# EasyEDA schematic smart auto charger_2020-04-23_15-03-07.json

## Sheets
1 First stage: TITLE: DDS Generator Gain; REV: 1.1; Date: 2020-01-05; Sheet: 1/4; Drawn By: Груздев А.С.; Company: GROOZDEV
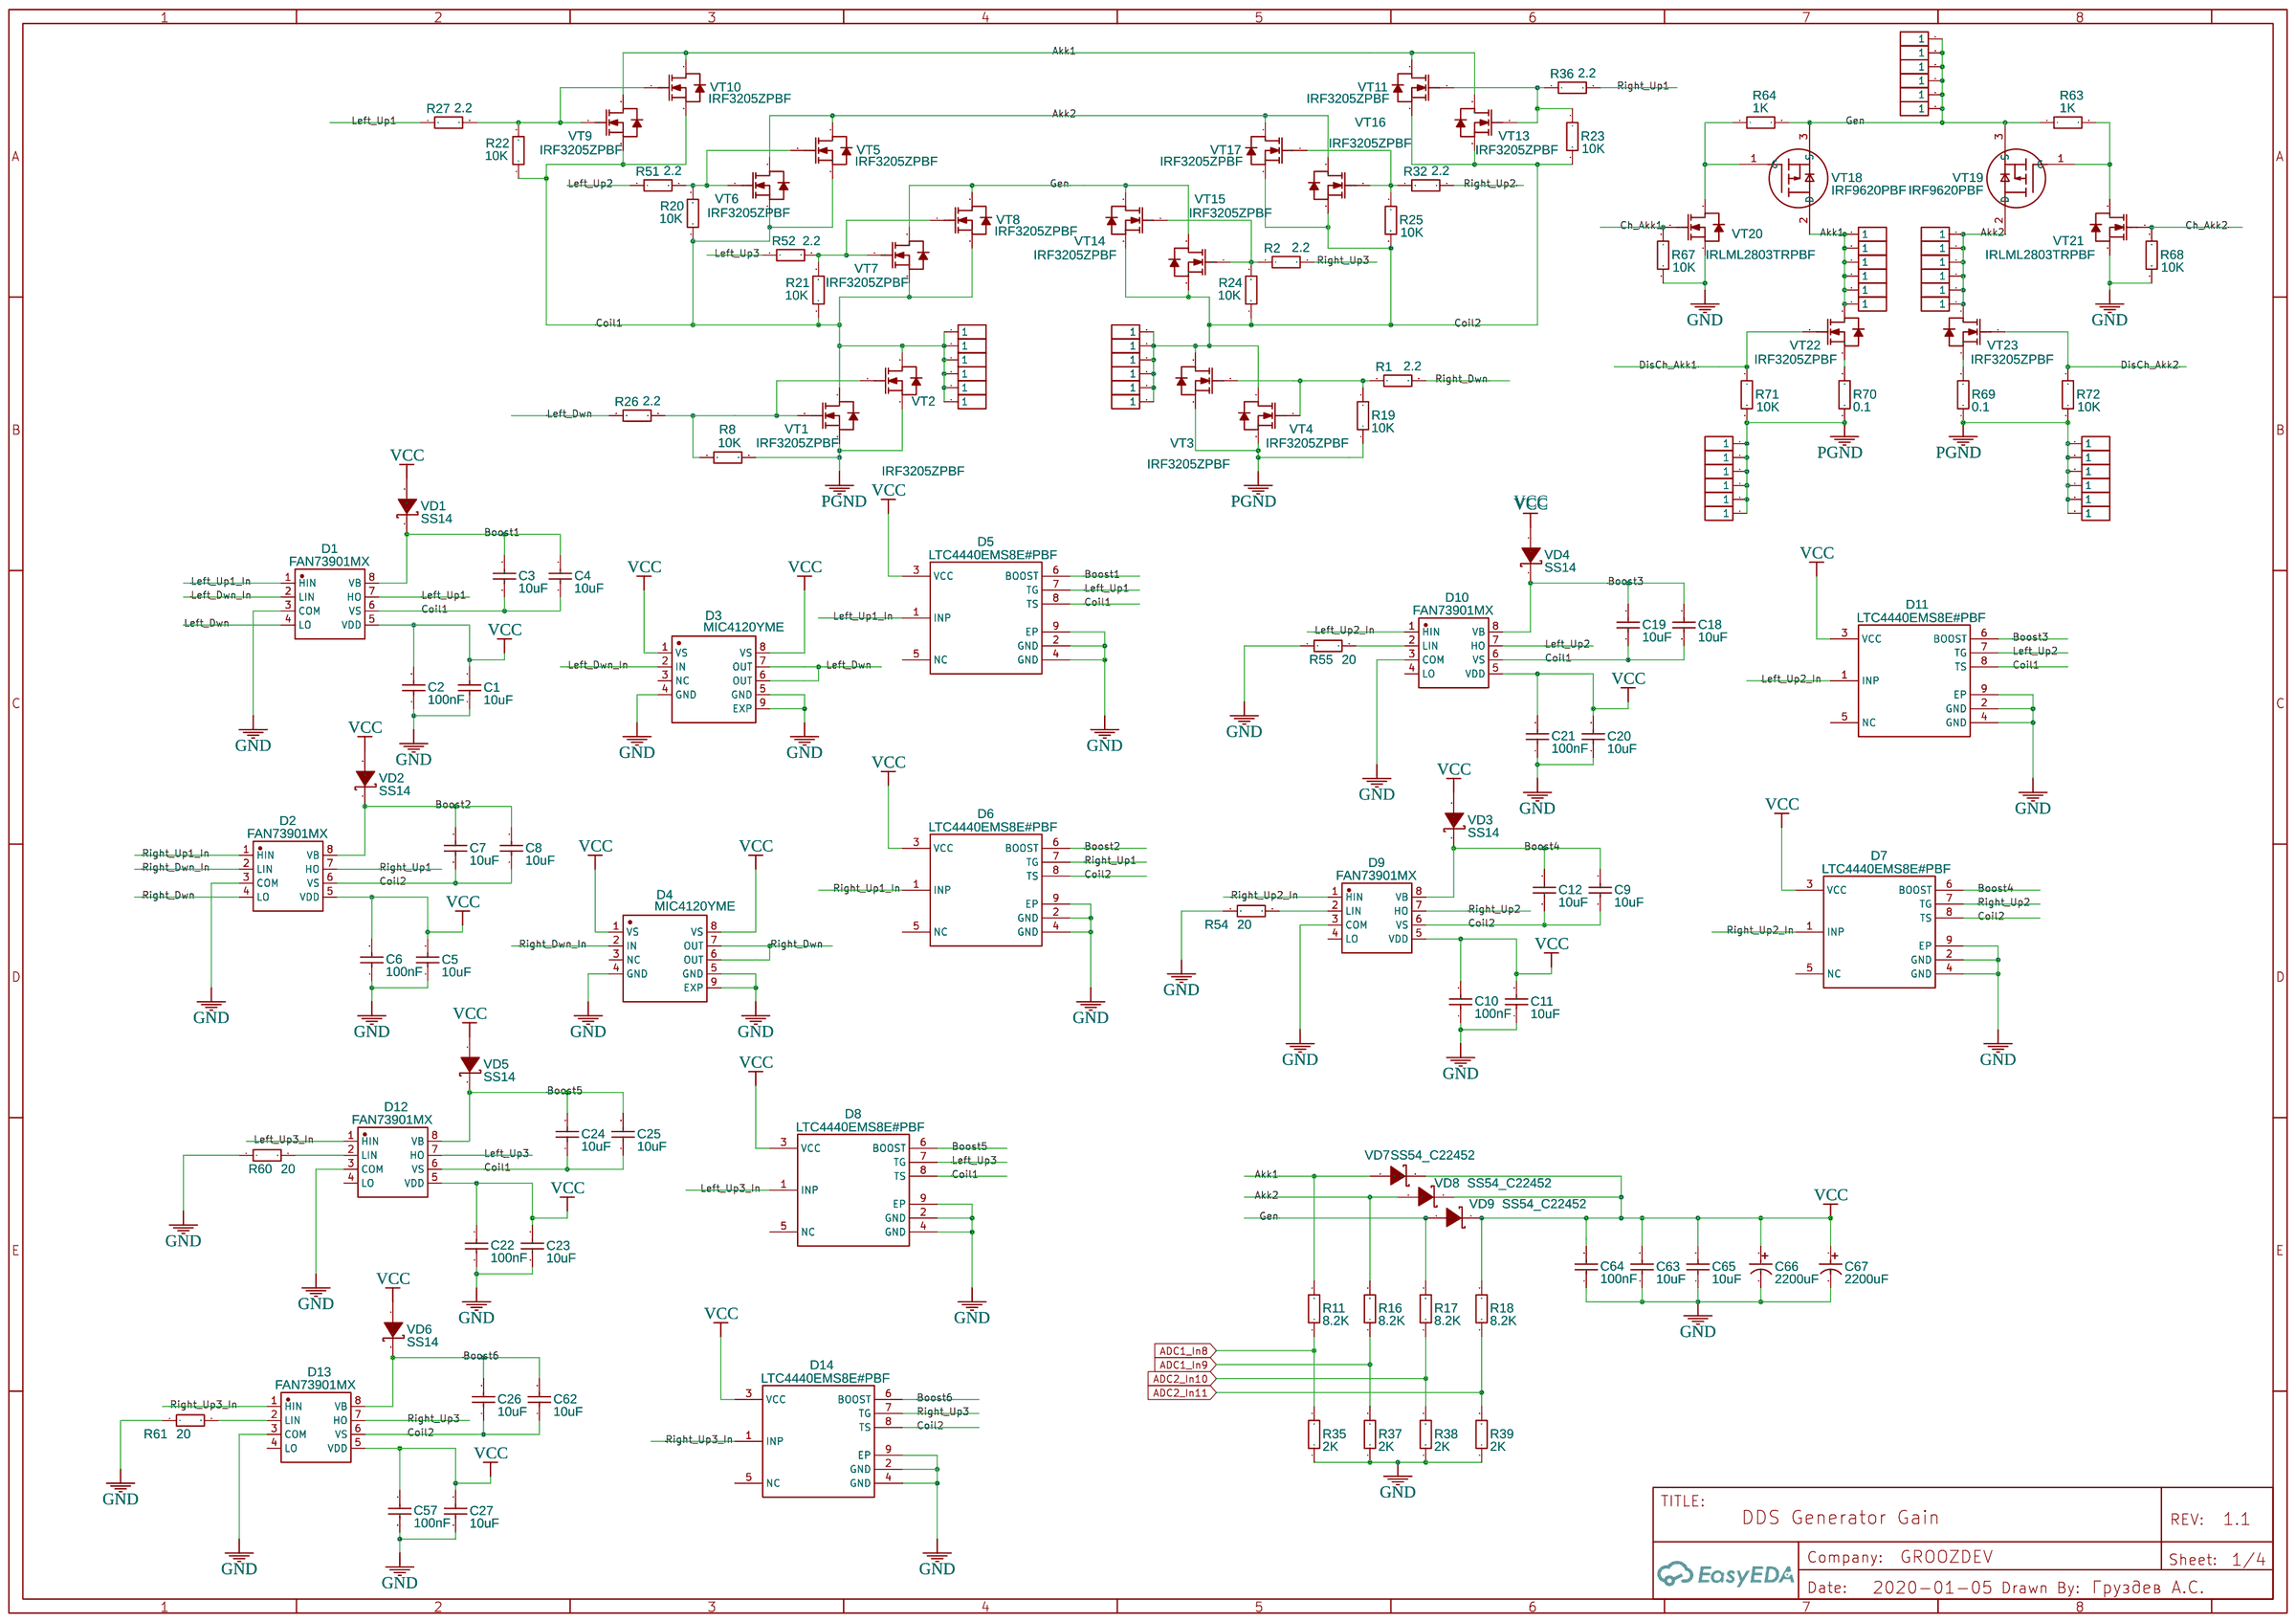
[diagram p0: First stage]
2 Second stage: TITLE: Ampifier; Date: 2020-01-06; Sheet: 2/4
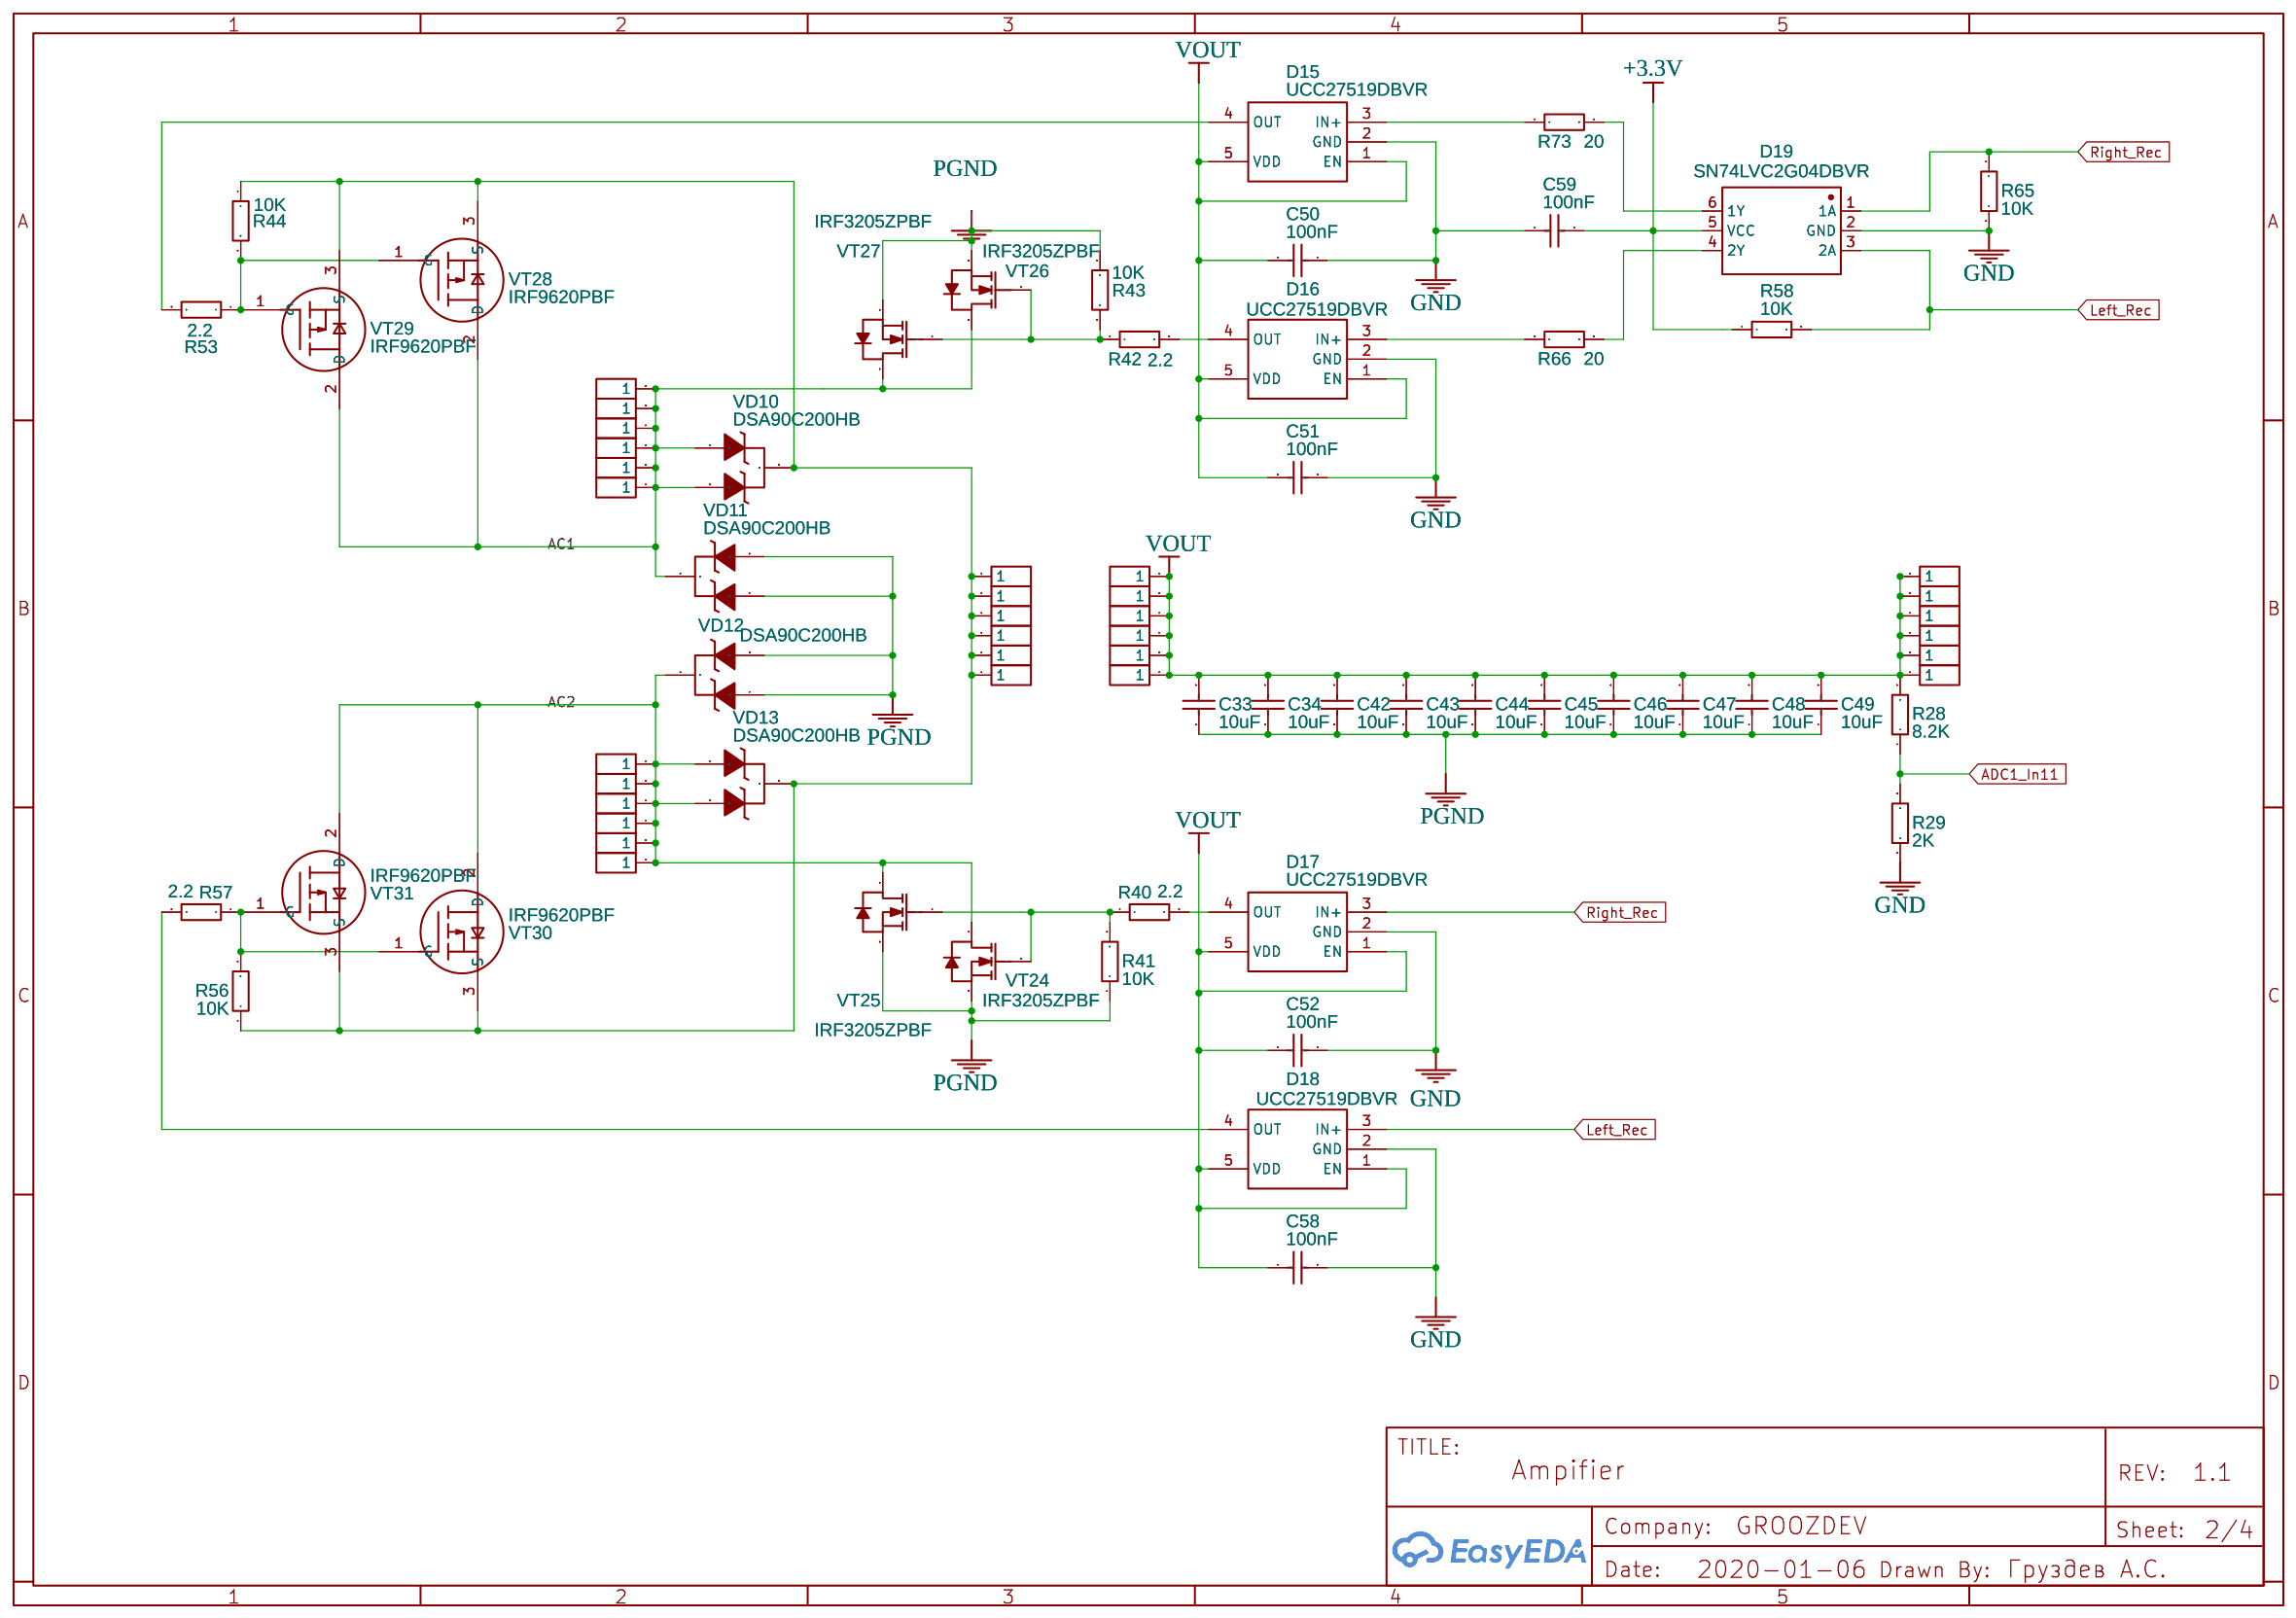
[diagram p1: Second stage]
3 USBtoVirtualCOM: TITLE: Interface; Date: 2020-01-15; Sheet: 3/4
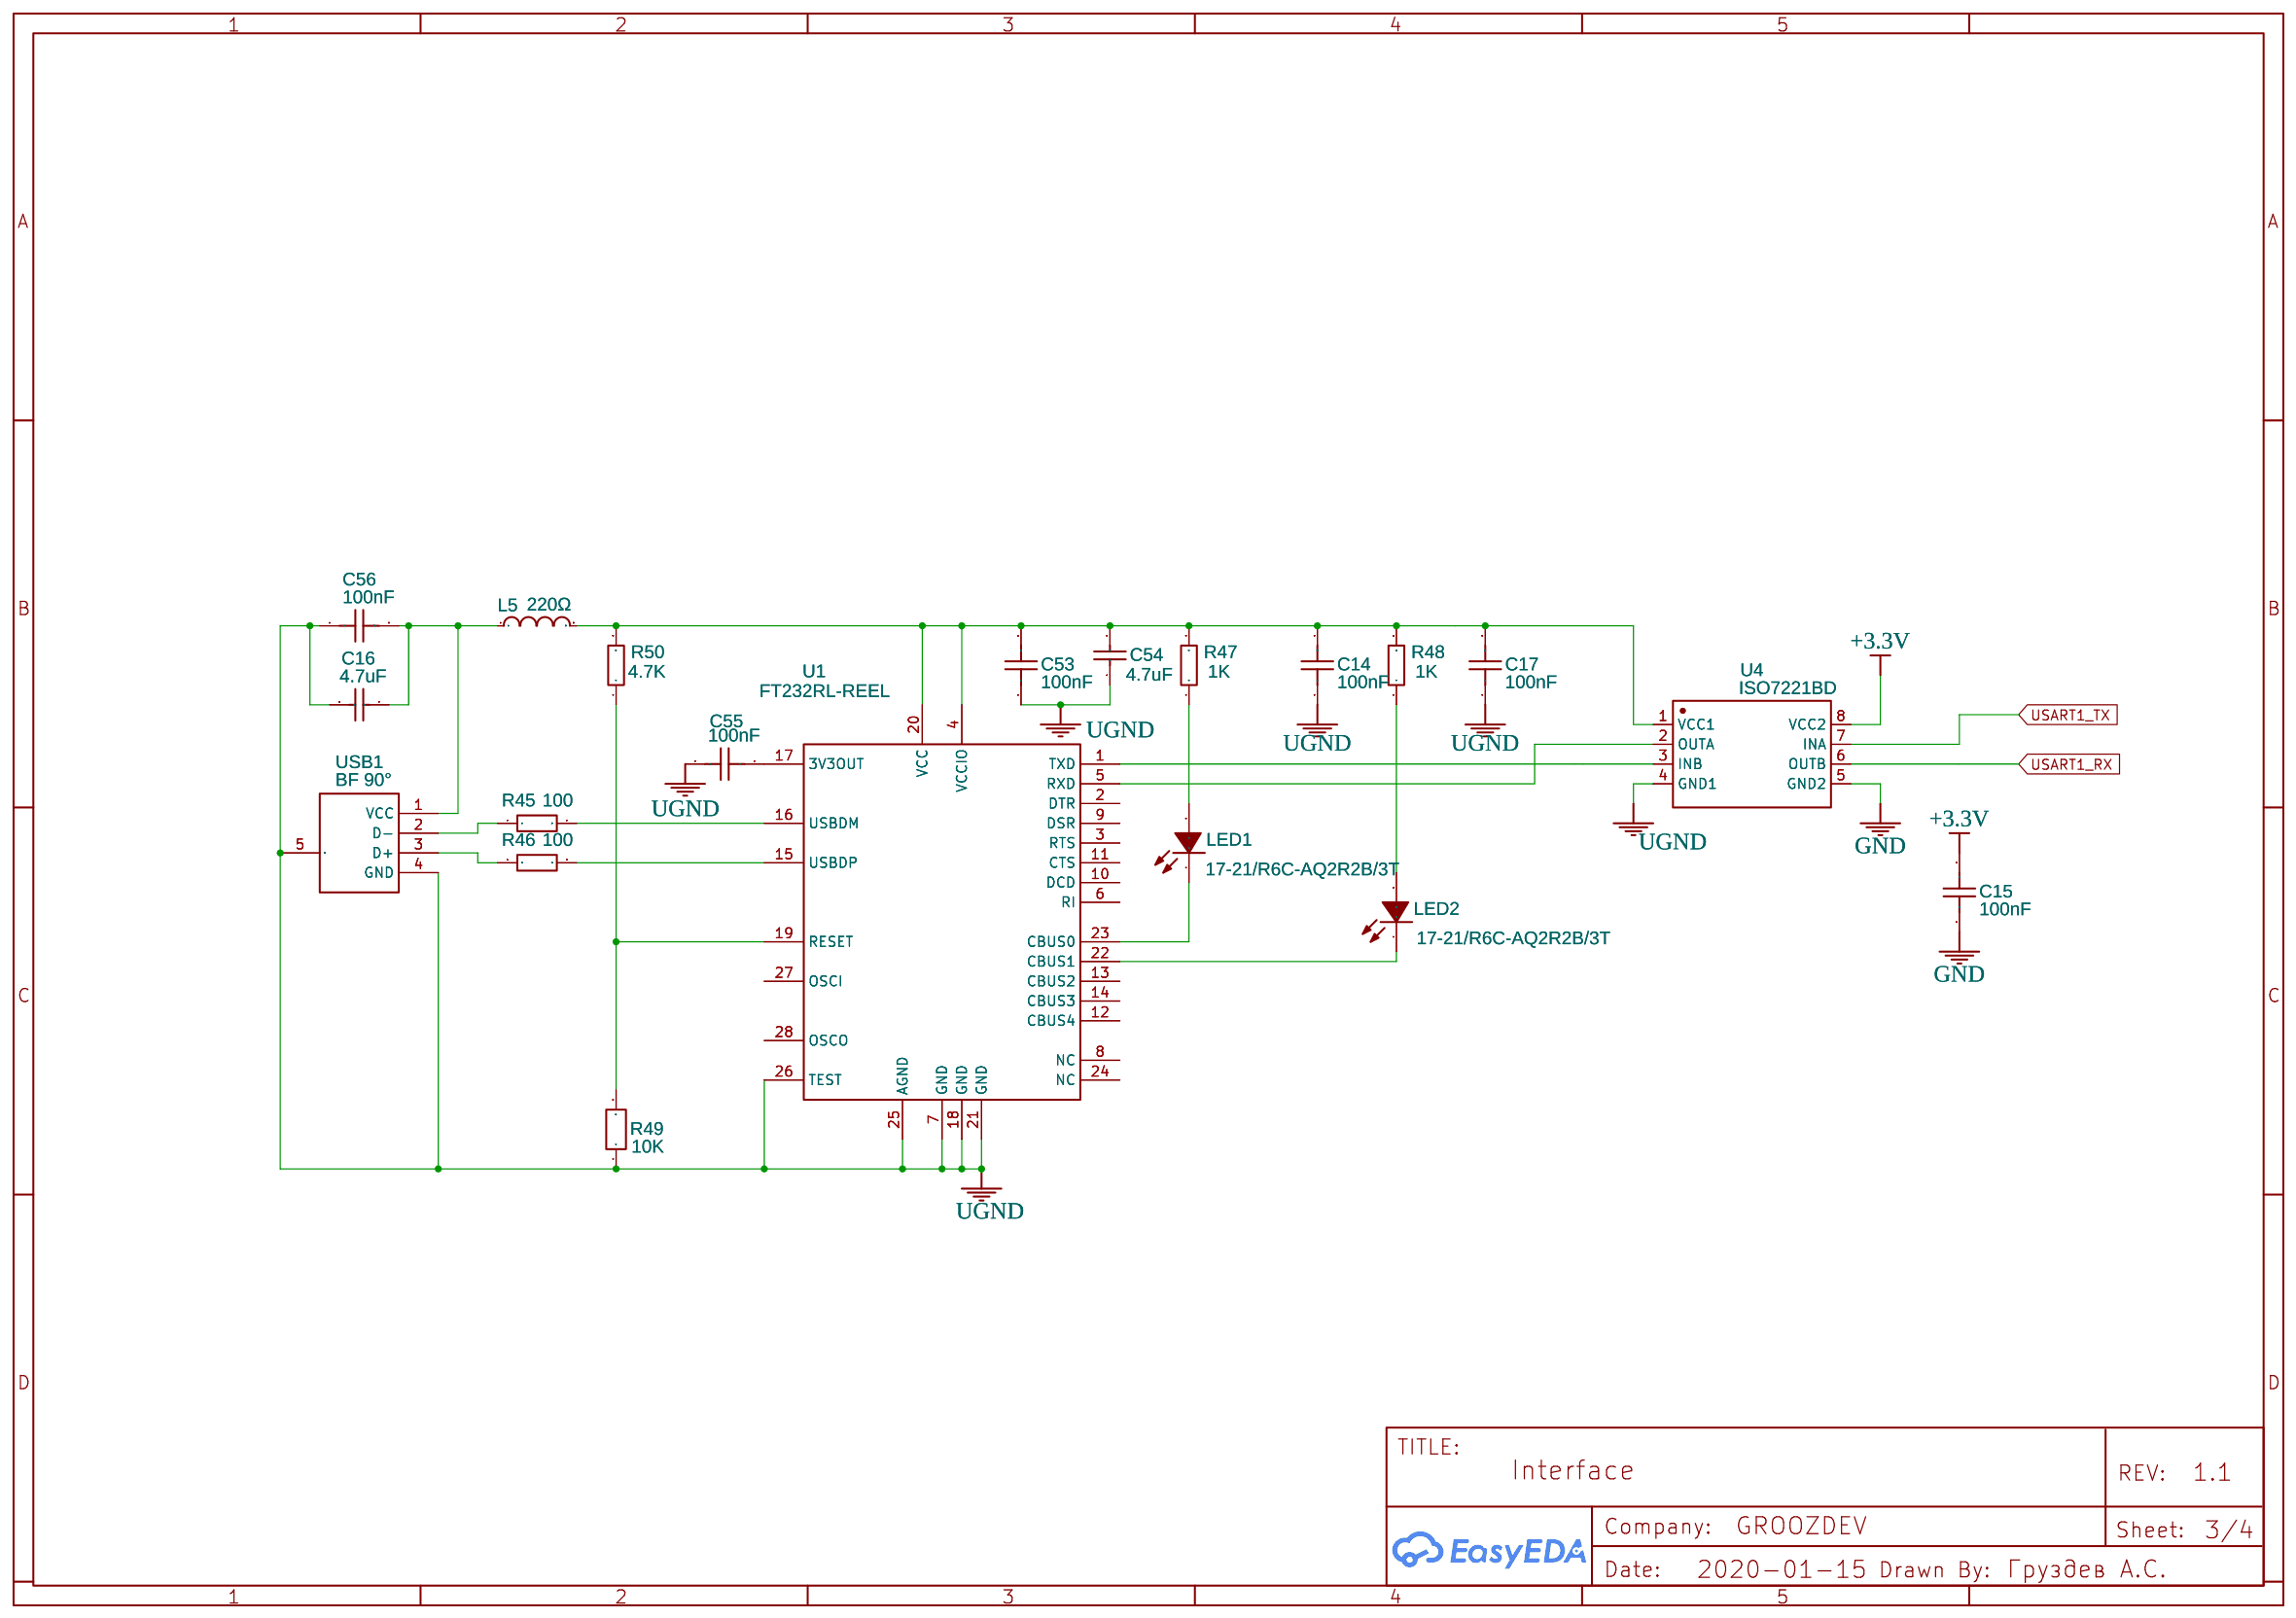
[diagram p2: USBtoVirtualCOM]
4 MCU_64: TITLE: MCU_64; Date: 2020-01-17; Sheet: 4/4
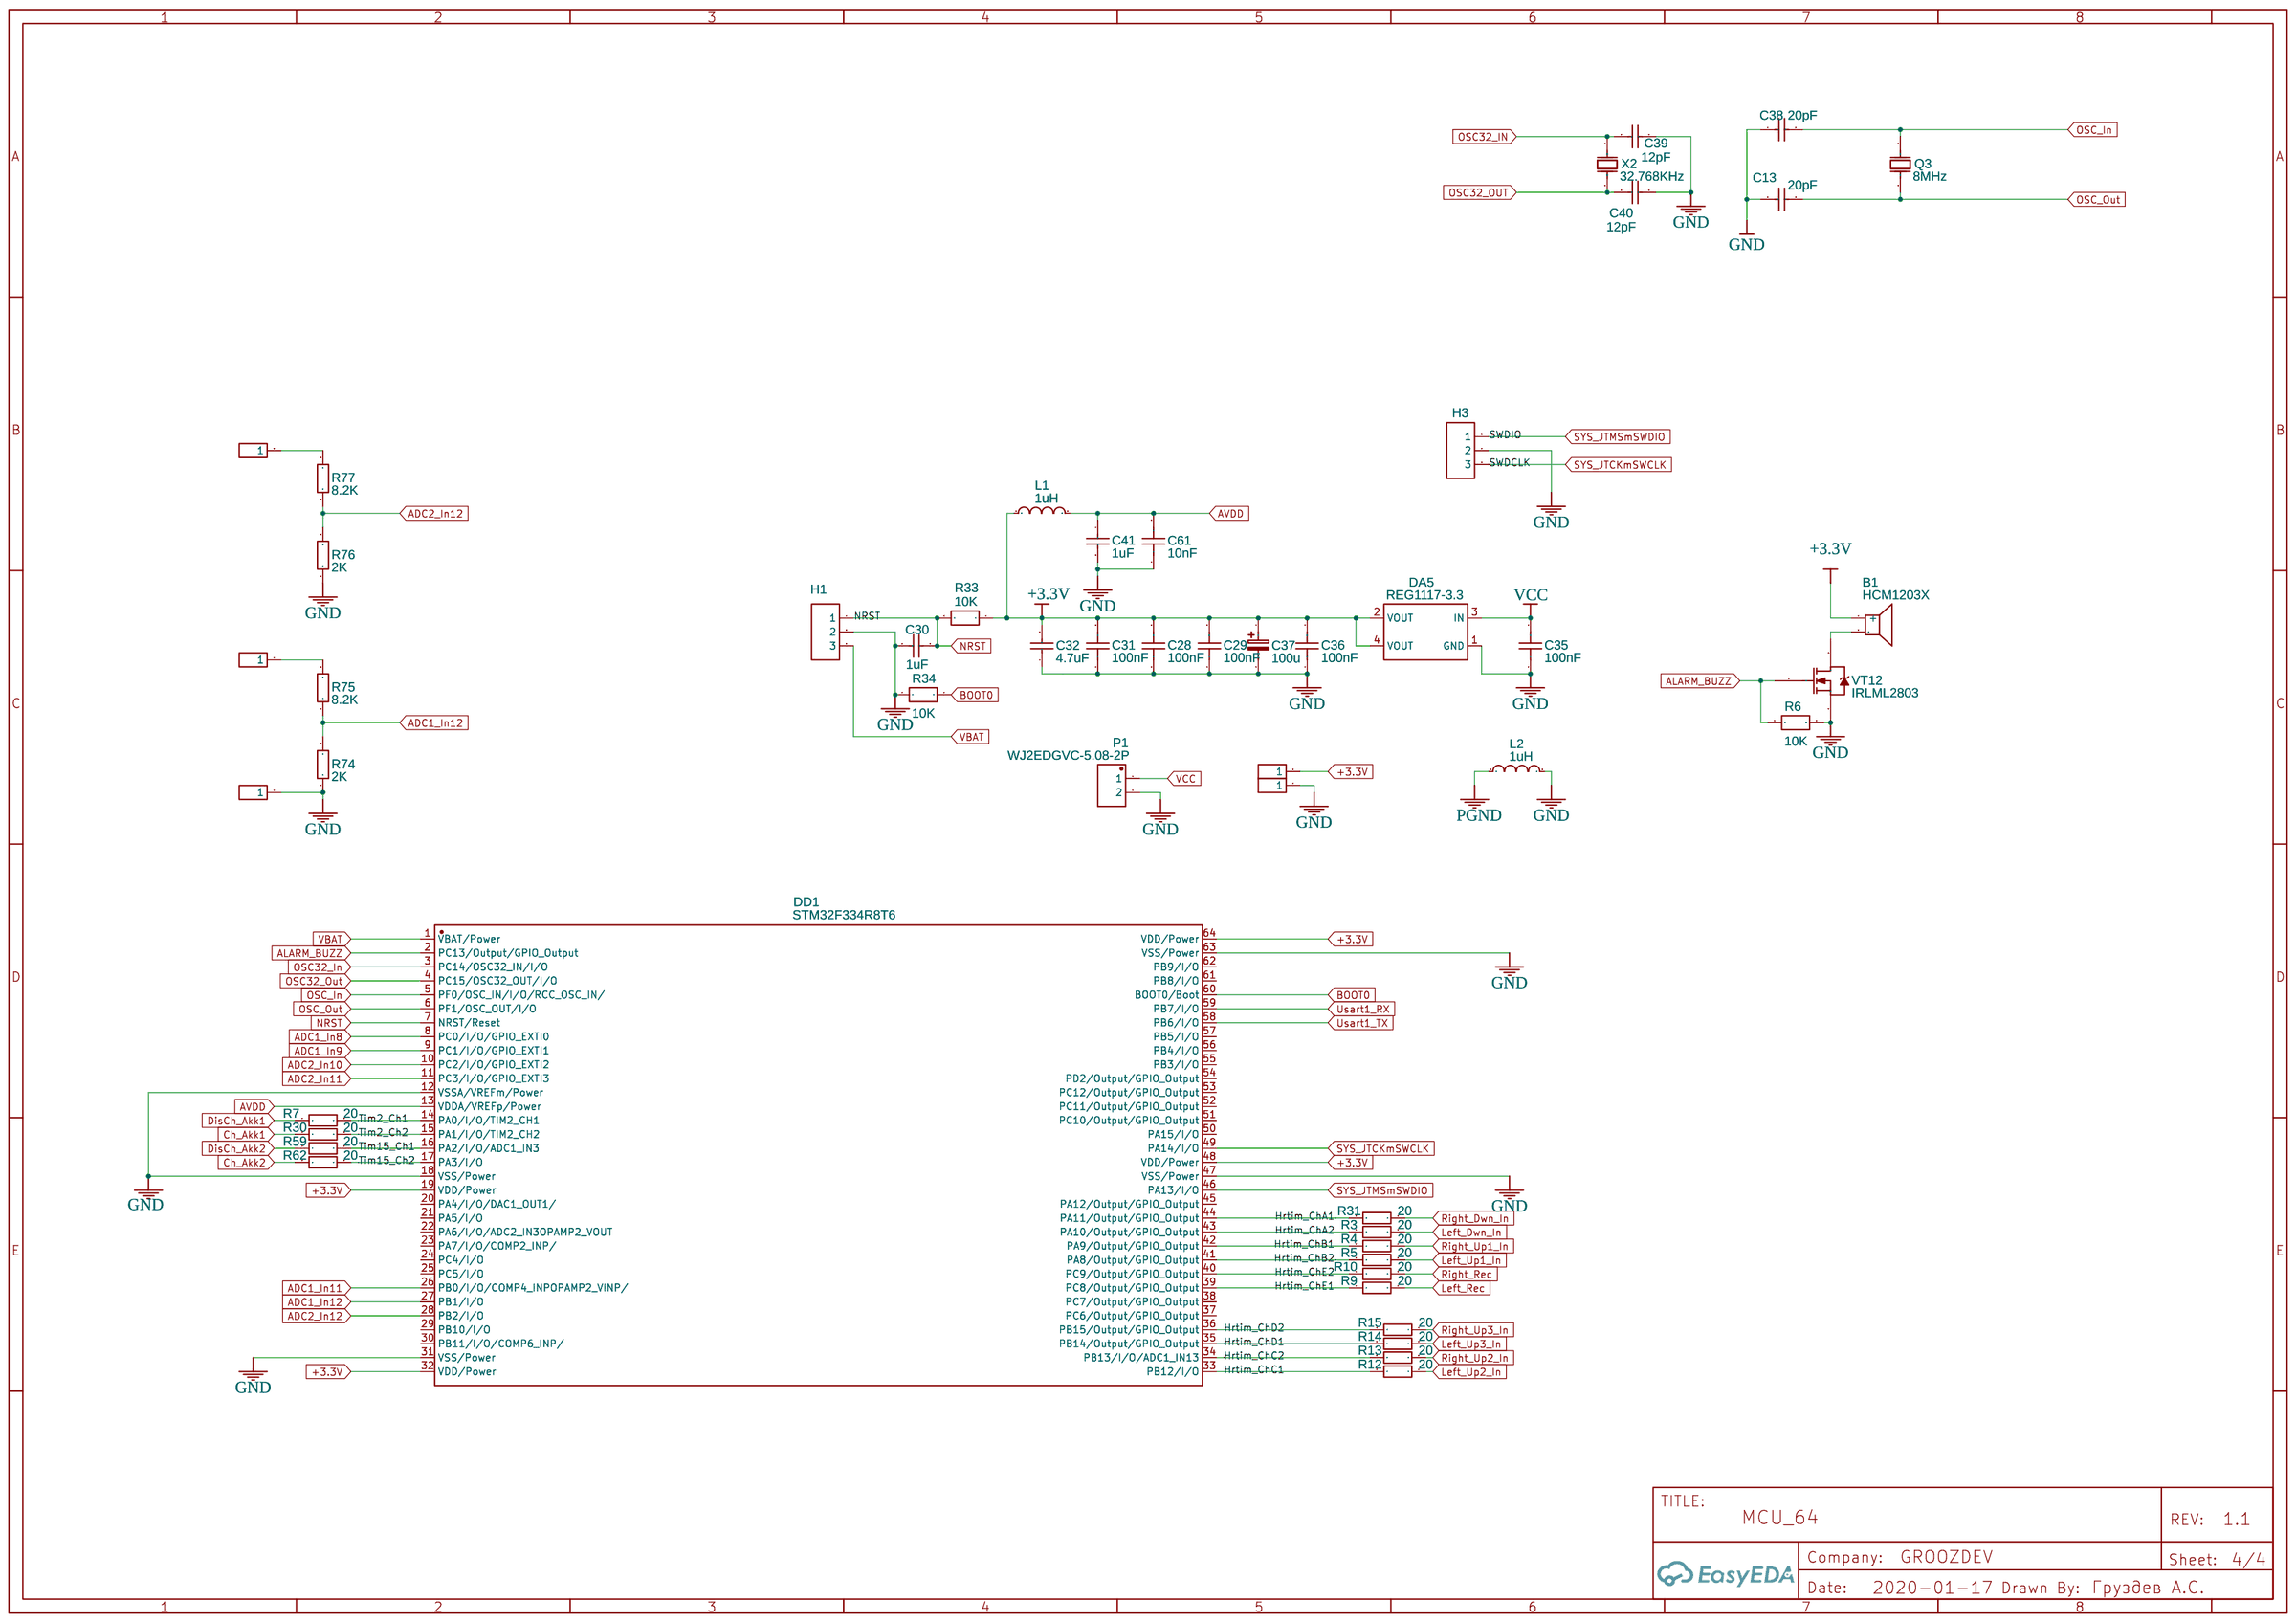
[diagram p3: MCU_64]

## Parts
sheet First stage
C1  10uF  [C1206]
C2  100nF  [C1206]
C3  10uF  [C1206]
C4  10uF  [C1206]
C5  10uF  [C1206]
C6  100nF  [C1206]
C7  10uF  [C1206]
C8  10uF  [C1206]
C9  10uF  [C1206]
C10  100nF  [C1206]
C11  10uF  [C1206]
C12  10uF  [C1206]
C18  10uF  [C1206]
C19  10uF  [C1206]
C20  10uF  [C1206]
C21  100nF  [C1206]
C22  100nF  [C1206]
C23  10uF  [C1206]
C24  10uF  [C1206]
C25  10uF  [C1206]
C26  10uF  [C1206]
C27  10uF  [C1206]
C57  100nF  [C1206]
C62  10uF  [C1206]
C63  10uF  [C1206]
C64  100nF  [C1206]
C65  10uF  [C1206]
C66  2200uF  [CAP-TH_BD16.0-P7.50-D1.2-FD]
C67  2200uF  [CAP-TH_BD16.0-P7.50-D1.2-FD]
D1  FAN73901MX  [SOIC-8_L5.0-W3.2-P1.27-LS8.3-BL]
D2  FAN73901MX  [SOIC-8_L5.0-W3.2-P1.27-LS8.3-BL]
D3  MIC4120YME  [SOIC-8_L5.0-W4.0-P1.27-LS6.0-BL-EP]
D4  MIC4120YME  [SOIC-8_L5.0-W4.0-P1.27-LS6.0-BL-EP]
D5  LTC4440EMS8E#PBF  [MSOP-8_L3.0-W3.0-P0.65-LS5.0-BL-EP]
D6  LTC4440EMS8E#PBF  [MSOP-8_L3.0-W3.0-P0.65-LS5.0-BL-EP]
D7  LTC4440EMS8E#PBF  [MSOP-8_L3.0-W3.0-P0.65-LS5.0-BL-EP]
D8  LTC4440EMS8E#PBF  [MSOP-8_L3.0-W3.0-P0.65-LS5.0-BL-EP]
D9  FAN73901MX  [SOIC-8_L5.0-W3.2-P1.27-LS8.3-BL]
D10  FAN73901MX  [SOIC-8_L5.0-W3.2-P1.27-LS8.3-BL]
D11  LTC4440EMS8E#PBF  [MSOP-8_L3.0-W3.0-P0.65-LS5.0-BL-EP]
D12  FAN73901MX  [SOIC-8_L5.0-W3.2-P1.27-LS8.3-BL]
D13  FAN73901MX  [SOIC-8_L5.0-W3.2-P1.27-LS8.3-BL]
D14  LTC4440EMS8E#PBF  [MSOP-8_L3.0-W3.0-P0.65-LS5.0-BL-EP]
P4  Header-Male-2.54_1x1  [HDR-1X1/2.54]
P5  Header-Male-2.54_1x1  [HDR-1X1/2.54]
P6  Header-Male-2.54_1x1  [HDR-1X1/2.54]
P7  Header-Male-2.54_1x1  [HDR-1X1/2.54]
P8  Header-Male-2.54_1x1  [HDR-1X1/2.54]
P9  Header-Male-2.54_1x1  [HDR-1X1/2.54]
P10  Header-Male-2.54_1x1  [HDR-1X1/2.54]
P11  Header-Male-2.54_1x1  [HDR-1X1/2.54]
P12  Header-Male-2.54_1x1  [HDR-1X1/2.54]
P13  Header-Male-2.54_1x1  [HDR-1X1/2.54]
P14  Header-Male-2.54_1x1  [HDR-1X1/2.54]
P15  Header-Male-2.54_1x1  [HDR-1X1/2.54]
P16  Header-Male-2.54_1x1  [HDR-1X1/2.54]
P17  Header-Male-2.54_1x1  [HDR-1X1/2.54]
P32  Header-Male-2.54_1x1  [HDR-1X1/2.54]
P33  Header-Male-2.54_1x1  [HDR-1X1/2.54]
P34  Header-Male-2.54_1x1  [HDR-1X1/2.54]
P35  Header-Male-2.54_1x1  [HDR-1X1/2.54]
P36  Header-Male-2.54_1x1  [HDR-1X1/2.54]
P37  Header-Male-2.54_1x1  [HDR-1X1/2.54]
P38  Header-Male-2.54_1x1  [HDR-1X1/2.54]
P39  Header-Male-2.54_1x1  [HDR-1X1/2.54]
P40  Header-Male-2.54_1x1  [HDR-1X1/2.54]
P41  Header-Male-2.54_1x1  [HDR-1X1/2.54]
P42  Header-Male-2.54_1x1  [HDR-1X1/2.54]
P43  Header-Male-2.54_1x1  [HDR-1X1/2.54]
P44  Header-Male-2.54_1x1  [HDR-1X1/2.54]
P45  Header-Male-2.54_1x1  [HDR-1X1/2.54]
P46  Header-Male-2.54_1x1  [HDR-1X1/2.54]
P47  Header-Male-2.54_1x1  [HDR-1X1/2.54]
P48  Header-Male-2.54_1x1  [HDR-1X1/2.54]
P49  Header-Male-2.54_1x1  [HDR-1X1/2.54]
P50  Header-Male-2.54_1x1  [HDR-1X1/2.54]
P51  Header-Male-2.54_1x1  [HDR-1X1/2.54]
P52  Header-Male-2.54_1x1  [HDR-1X1/2.54]
P53  Header-Male-2.54_1x1  [HDR-1X1/2.54]
P54  Header-Male-2.54_1x1  [HDR-1X1/2.54]
P55  Header-Male-2.54_1x1  [HDR-1X1/2.54]
P56  Header-Male-2.54_1x1  [HDR-1X1/2.54]
P57  Header-Male-2.54_1x1  [HDR-1X1/2.54]
P58  Header-Male-2.54_1x1  [HDR-1X1/2.54]
P59  Header-Male-2.54_1x1  [HDR-1X1/2.54]
R1  2.2  [R0603]
R2  2.2  [R0603]
R8  10K  [R0805]
R11  8.2K  [R0805]
R16  8.2K  [R0805]
R17  8.2K  [R0805]
R18  8.2K  [R0805]
R19  10K  [R0805]
R20  10K  [R0805]
R21  10K  [R0805]
R22  10K  [R0805]
R23  10K  [R0805]
R24  10K  [R0805]
R25  10K  [R0805]
R26  2.2  [R0603]
R27  2.2  [R0603]
R32  2.2  [R0603]
R35  2K  [R0805]
R36  2.2  [R0603]
R37  2K  [R0805]
R38  2K  [R0805]
R39  2K  [R0805]
R51  2.2  [R0603]
R52  2.2  [R0603]
R54  20  [R0603]
R55  20  [R0603]
R60  20  [R0603]
R61  20  [R0603]
R63  1K  [R1206]
R64  1K  [R1206]
R67  10K  [R0805]
R68  10K  [R0805]
R69  0.1  [R2512]
R70  0.1  [R2512]
R71  10K  [R0805]
R72  10K  [R0805]
VD1  SS14  [SMA_L4.3-W2.6-LS5.2-FD]
VD2  SS14  [SMA_L4.3-W2.6-LS5.2-FD]
VD3  SS14  [SMA_L4.3-W2.6-LS5.2-FD]
VD4  SS14  [SMA_L4.3-W2.6-LS5.2-FD]
VD5  SS14  [SMA_L4.3-W2.6-LS5.2-FD]
VD6  SS14  [SMA_L4.3-W2.6-LS5.2-FD]
VD7  SS54_C22452  [SMA_L4.4-W2.8-LS5.4-R-RD]
VD8  SS54_C22452  [SMA_L4.4-W2.8-LS5.4-R-RD]
VD9  SS54_C22452  [SMA_L4.4-W2.8-LS5.4-R-RD]
VT1  IRF3205ZPBF  [TO-220-3_L10.0-W4.5-P2.54-T]
VT2  IRF3205ZPBF  [TO-220-3_L10.0-W4.5-P2.54-T]
VT3  IRF3205ZPBF  [TO-220-3_L10.0-W4.5-P2.54-T]
VT4  IRF3205ZPBF  [TO-220-3_L10.0-W4.5-P2.54-T]
VT5  IRF3205ZPBF  [TO-220-3_L10.0-W4.5-P2.54-T]
VT6  IRF3205ZPBF  [TO-220-3_L10.0-W4.5-P2.54-T]
VT7  IRF3205ZPBF  [TO-220-3_L10.0-W4.5-P2.54-T]
VT8  IRF3205ZPBF  [TO-220-3_L10.0-W4.5-P2.54-T]
VT9  IRF3205ZPBF  [TO-220-3_L10.0-W4.5-P2.54-T]
VT10  IRF3205ZPBF  [TO-220-3_L10.0-W4.5-P2.54-T]
VT11  IRF3205ZPBF  [TO-220-3_L10.0-W4.5-P2.54-T]
VT13  IRF3205ZPBF  [TO-220-3_L10.0-W4.5-P2.54-T]
VT14  IRF3205ZPBF  [TO-220-3_L10.0-W4.5-P2.54-T]
VT15  IRF3205ZPBF  [TO-220-3_L10.0-W4.5-P2.54-T]
VT16  IRF3205ZPBF  [TO-220-3_L10.0-W4.5-P2.54-T]
VT17  IRF3205ZPBF  [TO-220-3_L10.0-W4.5-P2.54-T]
VT18  IRF9620PBF  [ITO-220AB-3_L10.2-W4.5-P2.60-L]
VT19  IRF9620PBF  [ITO-220AB-3_L10.2-W4.5-P2.60-L]
VT20  IRLML2803TRPBF  [SOT-23-3_L2.9-W1.3-P1.90-LS2.4-BR]
VT21  IRLML2803TRPBF  [SOT-23-3_L2.9-W1.3-P1.90-LS2.4-BR]
VT22  IRF3205ZPBF  [TO-220-3_L10.0-W4.5-P2.54-T]
VT23  IRF3205ZPBF  [TO-220-3_L10.0-W4.5-P2.54-T]
sheet MCU_64
B1  HCM1203X  [B-12MM*H7.5MM]
C13  20pF  [C0603]
C28  100nF  [0805]
C29  100nF  [0805]
C30  1uF  [0805]
C31  100nF  [0805]
C32  4.7uF  [C0805]
C35  100nF  [0805]
C36  100nF  [0805]
C37  100u  [CASE-D_7343]
C38  20pF  [C0603]
C39  12pF  [C0603]
C40  12pF  [C0603]
C41  1uF  [0805]
C61  10nF  [C0805]
DA5  REG1117-3.3  [SOT-223-4_L6.5-W3.5-P2.30-LS7.0-BR]
DD1  STM32F334R8T6  [LQFP-64_L10.0-W10.0-P0.50-LS12.0-TL]
H1  Header-Male-2.54_1x3  [HDR-TH_3P-P2.54-V]
H3  Header-Male-2.54_1x3  [HDR-TH_3P-P2.54-V]
L1  1uH  [L0805]
L2  1uH  [L0805]
P1  WJ2EDGVC-5.08-2P  [WJ2EDGVC-5.08-2P]
P18  Header-Male-2.54_1x1  [HDR-1X1/2.54]
P19  Header-Male-2.54_1x1  [HDR-1X1/2.54]
P20  Header-Male-2.54_1x1  [HDR-1X1/2.54]
P21  Header-Male-2.54_1x1  [HDR-1X1/2.54]
P22  Header-Male-2.54_1x1  [HDR-1X1/2.54]
Q3  8MHz  [OSC-SMD_L5.0-W3.2]
R3  20  [R0603]
R4  20  [R0603]
R5  20  [R0603]
R6  10K  [R0805]
R7  20  [R0603]
R9  20  [R0603]
R10  20  [R0603]
R12  20  [R0603]
R13  20  [R0603]
R14  20  [R0603]
R15  20  [R0603]
R30  20  [R0603]
R31  20  [R0603]
R33  10K  [R0805]
R34  10K  [R0805]
R59  20  [R0603]
R62  20  [R0603]
R74  2K  [R0805]
R75  8.2K  [R0805]
R76  2K  [R0805]
R77  8.2K  [R0805]
VT12  IRLML2803  [SOT23-3]
X2  32.768KHz  [OSC-SMD_L3.2-W1.5]
sheet Second stage
C33  10uF  [C1206]
C34  10uF  [C1206]
C42  10uF  [C1206]
C43  10uF  [C1206]
C44  10uF  [C1206]
C45  10uF  [C1206]
C46  10uF  [C1206]
C47  10uF  [C1206]
C48  10uF  [C1206]
C49  10uF  [C1206]
C50  100nF  [C0805]
C51  100nF  [C0805]
C52  100nF  [C0805]
C58  100nF  [C0805]
C59  100nF  [C0805]
D15  UCC27519DBVR  [SOT-23-5_L3.0-W1.7-P0.95-LS2.8-BR]
D16  UCC27519DBVR  [SOT-23-5_L3.0-W1.7-P0.95-LS2.8-BR]
D17  UCC27519DBVR  [SOT-23-5_L3.0-W1.7-P0.95-LS2.8-BR]
D18  UCC27519DBVR  [SOT-23-5_L3.0-W1.7-P0.95-LS2.8-BR]
D19  SN74LVC2G04DBVR  [SOT-23-6_L2.9-W1.6-P0.95-LS2.8-BL]
P2  Header-Male-2.54_1x1  [HDR-1X1/2.54]
P3  Header-Male-2.54_1x1  [HDR-1X1/2.54]
P23  Header-Male-2.54_1x1  [HDR-1X1/2.54]
P24  Header-Male-2.54_1x1  [HDR-1X1/2.54]
P25  Header-Male-2.54_1x1  [HDR-1X1/2.54]
P26  Header-Male-2.54_1x1  [HDR-1X1/2.54]
P27  Header-Male-2.54_1x1  [HDR-1X1/2.54]
P28  Header-Male-2.54_1x1  [HDR-1X1/2.54]
P29  Header-Male-2.54_1x1  [HDR-1X1/2.54]
P30  Header-Male-2.54_1x1  [HDR-1X1/2.54]
P31  Header-Male-2.54_1x1  [HDR-1X1/2.54]
P60  Header-Male-2.54_1x1  [HDR-1X1/2.54]
P61  Header-Male-2.54_1x1  [HDR-1X1/2.54]
P62  Header-Male-2.54_1x1  [HDR-1X1/2.54]
P63  Header-Male-2.54_1x1  [HDR-1X1/2.54]
P64  Header-Male-2.54_1x1  [HDR-1X1/2.54]
P65  Header-Male-2.54_1x1  [HDR-1X1/2.54]
P66  Header-Male-2.54_1x1  [HDR-1X1/2.54]
P67  Header-Male-2.54_1x1  [HDR-1X1/2.54]
P68  Header-Male-2.54_1x1  [HDR-1X1/2.54]
P69  Header-Male-2.54_1x1  [HDR-1X1/2.54]
P70  Header-Male-2.54_1x1  [HDR-1X1/2.54]
P71  Header-Male-2.54_1x1  [HDR-1X1/2.54]
P72  Header-Male-2.54_1x1  [HDR-1X1/2.54]
P73  Header-Male-2.54_1x1  [HDR-1X1/2.54]
P74  Header-Male-2.54_1x1  [HDR-1X1/2.54]
P75  Header-Male-2.54_1x1  [HDR-1X1/2.54]
P76  Header-Male-2.54_1x1  [HDR-1X1/2.54]
P77  Header-Male-2.54_1x1  [HDR-1X1/2.54]
P78  Header-Male-2.54_1x1  [HDR-1X1/2.54]
R28  8.2K  [R0805]
R29  2K  [R0805]
R40  2.2  [R0603]
R41  10K  [R0805]
R42  2.2  [R0603]
R43  10K  [R0805]
R44  10K  [R0805]
R53  2.2  [R0603]
R56  10K  [R0805]
R57  2.2  [R0603]
R58  10K  [R0603]
R65  10K  [R0603]
R66  20  [R0603]
R73  20  [R0603]
VD10  DSA90C200HB  [TO-247AD_L15.8-W5.0-P5.44-L]
VD11  DSA90C200HB  [TO-247AD_L15.8-W5.0-P5.44-L]
VD12  DSA90C200HB  [TO-247AD_L15.8-W5.0-P5.44-L]
VD13  DSA90C200HB  [TO-247AD_L15.8-W5.0-P5.44-L]
VT24  IRF3205ZPBF  [TO-220-3_L10.0-W4.5-P2.54-T]
VT25  IRF3205ZPBF  [TO-220-3_L10.0-W4.5-P2.54-T]
VT26  IRF3205ZPBF  [TO-220-3_L10.0-W4.5-P2.54-T]
VT27  IRF3205ZPBF  [TO-220-3_L10.0-W4.5-P2.54-T]
VT28  IRF9620PBF  [ITO-220AB-3_L10.2-W4.5-P2.60-L]
VT29  IRF9620PBF  [ITO-220AB-3_L10.2-W4.5-P2.60-L]
VT30  IRF9620PBF  [ITO-220AB-3_L10.2-W4.5-P2.60-L]
VT31  IRF9620PBF  [ITO-220AB-3_L10.2-W4.5-P2.60-L]
sheet USBtoVirtualCOM
C14  100nF  [0805]
C15  100nF  [0805]
C16  4.7uF  [C0805]
C17  100nF  [0805]
C53  100nF  [0805]
C54  4.7uF  [C0805]
C55  100nF  [0805]
C56  100nF  [0805]
L5  220Ω  [L0805]
LED1  17-21/R6C-AQ2R2B/3T  [LED0805-RD]
LED2  17-21/R6C-AQ2R2B/3T  [LED0805-RD]
R45  100  [0805]
R46  100  [0805]
R47  1K  [R0805]
R48  1K  [R0805]
R49  10K  [R0805]
R50  4.7K  [R0805]
U1  FT232RL-REEL  [SSOP-28_L10.2-W5.3-P0.65-LS7.8-BL]
U4  ISO7221BD  [SOIC-8]
USB1  BF 90°  [USB-B_TH_BF90]

## Library data of the parts
C1 C3-C5 C7-C9 C11 C12 C18-C20 C23-C27 C33 C34 C42-C49 C62 C63 C65 = CL31A106KBHNNNE: Supplier: LCSC; Manufacturer: SAMSUNG; LCSC Assembly: Yes; Supplier Part: C13585; SMT Type: Basic
C2 C6 C10 C21 C22 C57 C64 = CL31B104KCFNNNE: Supplier: LCSC; Manufacturer: SAMSUNG; Supplier Part: C1945; LCSC Assembly: Yes; SMT Type: Extend
C66 C67 = 2200uF 35V 16X25: Supplier: LCSC; Manufacturer: ValuePro; Supplier Part: C2763
D1 D2 D9 D10 D12 D13 = FAN73901MX: Supplier: LCSC; Supplier Part: C380794; Manufacturer: ON Semicon; Contributor: LCSC; LCSC Assembly: Yes; SMT Type: Extend
D3 D4 = MIC4120YME: Supplier: LCSC; Manufacturer: MICROCHIP; Contributor: LCSC; Supplier Part: C145580; LCSC Assembly: Yes; SMT Type: Extend
D5-D8 D11 D14 = LTC4440EMS8E#PBF: Supplier: LCSC; Manufacturer: LINEAR; Supplier Part: C107973; LCSC Assembly: Yes; SMT Type: Extend
P2-P78 = Header-Male-2.54_1x1: Supplier: LCSC; Manufacturer: ReliaPro; Supplier Part: C81276
R1 R2 R26 R27 R32 R36 R40 R42 R51-R53 R57 = 0603WAF220KT5E: Supplier: LCSC; Manufacturer: UniOhm; LCSC Assembly: Yes; Supplier Part: C22939; SMT Type: Basic
R8 R19-R25 R41 R43 R44 R56 R67 R68 R71 R72 = 0805W8F1002T5E: Supplier: LCSC; Manufacturer: UniOhm; LCSC Assembly: Yes; Supplier Part: C17414; SMT Type: Basic
R11 R16-R18 R28 R75 R77 = 0805W8F8201T5E: Supplier: LCSC; Manufacturer: UniOhm; LCSC Assembly: Yes; Supplier Part: C17828; SMT Type: Basic
R29 R35 R37-R39 R74 R76 = 0805W8F2001T5E: Supplier: LCSC; Manufacturer: UniOhm; LCSC Assembly: Yes; Supplier Part: C17604; SMT Type: Basic
R3-R5 R7 R9 R10 R12-R15 R30 R31 R54 R55 R59-R62 R66 R73 = 0603WAF200JT5E: Supplier: LCSC; Manufacturer: UniOhm; LCSC Assembly: Yes; Supplier Part: C22950; SMT Type: Basic
R63 R64 = 1206W4F1001T5E: Supplier: LCSC; Manufacturer: UniOhm; LCSC Assembly: Yes; Supplier Part: C4410; SMT Type: Basic
R69 R70 = MRF6432(2512)LR100FTS: Supplier: LCSC; Manufacturer: SUP; Supplier Part: C76254; LCSC Assembly: Yes; SMT Type: Extend
VD1-VD6 = SS14: Supplier: LCSC; Manufacturer: MDD; image: //image.lceda.cn/szlcsc/C2480.jpg; Supplier Part: C2480; LCSC Assembly: Yes; SMT Type: Basic
VD7-VD9 = SS54_C22452: Supplier: LCSC; Manufacturer Part: SS54; LCSC Assembly: Yes; Manufacturer: MDD; image: //image.lceda.cn/szlcsc/C22452.jpg; Supplier Part: C22452; SMT Type: Basic
VT1-VT11 VT13-VT17 VT22-VT27 = IRF3205ZPBF: Supplier: LCSC; Manufacturer: Infineon; image: //image.lceda.cn/szlcsc/C2612.jpg; Supplier Part: C2612
VT18 VT19 VT28-VT31 = IRF9620PBF: Supplier: LCSC; Manufacturer: VISHAY; Contributor: LCSC; Supplier Part: C145334
VT20 VT21 = IRLML2803TRPBF: Supplier: LCSC; Manufacturer: Infineon; Supplier Part: C2590; LCSC Assembly: Yes; SMT Type: Extend
B1 = HCM1203X: EasyEDA: E49617; Supplier Part: https://www.chipdip.ru/product/hcm1203x; Supplier: Chip-dip
C13 C38 = CL10C200JB8NNNC: Supplier: LCSC; Manufacturer: SAMSUNG; LCSC Assembly: Yes; Supplier Part: C1648; SMT Type: Basic
C14 C15 C17 C28 C29 C31 C35 C36 C53 C55 C56 = CT41G-0805-2X1-50V-0.1UF-K(N): Supplier: LCSC; Supplier Part: C126469; Manufacturer: TORCH; Manufacturer Part: CT41G-0805-2X1-50V-0.1uF-K(N); Contributor: LCSC
C30 C41 = CL21B105KAFNFNE: Supplier: LCSC; Manufacturer: SAMSUNG; Supplier Part: C1712
C16 C32 C54 = C2012X7R1A475KT000N: Supplier: LCSC; Manufacturer: TDK; Supplier Part: C76639
C37 = Cap_Tantalum(SMD)_D-7343_EU: Contributor: EasyEDA
C39 C40 = CL10C120JB8NNNC: Supplier: LCSC; Manufacturer: SAMSUNG; LCSC Assembly: Yes; Supplier Part: C38523; SMT Type: Basic
C61 = GCM216R71H103KA37D: Supplier: LCSC; Supplier Part: C388908; Manufacturer: Murata Electronics; Contributor: LCSC
DA5 = REG1117-3.3: Supplier: LCSC; Supplier Part: C132201; Manufacturer: Texas Instruments; Contributor: LCSC
DD1 = STM32F334R8T6
H1 H3 = Header-Male-2.54_1x3: Supplier: LCSC; Manufacturer: BOOMELE; Manufacturer Part: Header2.54mm 1*3P; image: //image.lceda.cn/szlcsc/C49257.jpg; Supplier Part: C49257
L1 L2 = SDFL2012Q1R0KTF: Supplier: LCSC; Manufacturer: Sunlord; LCSC Assembly: Yes; Supplier Part: C1042; SMT Type: Basic
P1 = WJ2EDGVC-5.08-2P: Supplier: LCSC; Manufacturer: ReliaPro; image: //image.lceda.cn/szlcsc/C8445.jpg; Supplier Part: C8445
Q3 = X50328MSB2GI: Supplier: LCSC; Manufacturer: YXC; LCSC Assembly: Yes; Supplier Part: C115962; SMT Type: Basic
R6 R33 R34 R49 = CR-05FL7---10K: Supplier: LCSC; Supplier Part: C416062; Manufacturer: Viking Tech; Contributor: LCSC
VT12 = IRLML2803: HEXFET Power MOSFET
X2 = EXS00A-MU00202: Supplier: LCSC; Supplier Part: C280830; Manufacturer: Nihon Dempa Kogyo; Contributor: LCSC
C50-C52 C58 C59 = CC0805KRX7R9BB104: Supplier: LCSC; Manufacturer: YAGEO; LCSC Assembly: Yes; Supplier Part: C49678; SMT Type: Basic
D15-D18 = UCC27519DBVR: Supplier: LCSC; Manufacturer: TI; Supplier Part: C93674; LCSC Assembly: Yes; SMT Type: Extend
D19 = SN74LVC2G04DBVR: Supplier: LCSC; Manufacturer: TI; image: //image.lceda.cn/szlcsc/C10428.jpg; Supplier Part: C10428; LCSC Assembly: Yes; SMT Type: Extend
R58 R65 = 0603WAF1002T5E: Supplier: LCSC; Manufacturer: UniOhm; LCSC Assembly: Yes; Supplier Part: C25804; SMT Type: Basic
VD10-VD13 = DSA90C200HB: Supplier: LCSC; Supplier Part: C480636; Manufacturer: IXYS; Contributor: LCSC
L5 = BLM21PG221SH1D: Supplier: LCSC; Manufacturer: MuRata; Supplier Part: C88994
LED1 LED2 = 17-21/R6C-AQ2R2B/3T: Supplier: LCSC; Manufacturer: EVERLIGHT; Contributor: LCSC; Supplier Part: C113551
R45 R46 = RC0805JR-7W100RL: Supplier: LCSC; Supplier Part: C309572; Manufacturer: YAGEO; Contributor: LCSC
R47 R48 = RM10JTN102: Supplier: LCSC; Manufacturer: TA-I; Supplier Part: C113195
R50 = RMC08054.7K5%N: Supplier: LCSC; Supplier Part: C269733; Manufacturer: Tyohm; Contributor: LCSC
U1 = FT232RL-REEL: Supplier: LCSC; Manufacturer: FTDI; LCSC Assembly: Yes; image: //image.lceda.cn/szlcsc/C8690.jpg; Supplier Part: C8690; SMT Type: Basic
U4 = ISO7221BD
USB1 = BF 90°: Supplier: LCSC; Supplier Part: C456014; Manufacturer: SHOU HAN; Contributor: LCSC

## Nets
+3.3V: B1.1(+) C15.2 C28.2 C29.2 C31.2 C32.2 C36.2 C37.1 C59.2 D19.5(VCC) DA5.2(VOUT) DA5.4(VOUT) DD1.19(VDD/Power) DD1.32(VDD/Power) DD1.48(VDD/Power) DD1.64(VDD/Power) L1.1 P18.1 R33.1 R58.1 U4.8(VCC2)
AVDD: C41.1 C61.2 DD1.13(VDDA/VREFp/Power) L1.2
GND: C1.1 C2.1 C5.1 C6.1 C10.1 C11.1 C13.1 C15.1 C20.1 C21.1 C22.1 C23.1 C27.1 C28.1 C29.1 C30.2 C31.1 C32.1 C35.1 C36.1 C37.2 C38.1 C39.2 C40.2 C41.2 C50.2 C51.2 C52.2 C57.1 C58.2 C59.1 C61.1 C63.1 C64.1 C65.1 C66.2 C67.2 D1.3(COM) D2.3(COM) D3.4(GND) D3.5(GND) D3.9(EXP) D4.4(GND) D4.5(GND) D4.9(EXP) D5.2(GND) D5.4(GND) D5.9(EP) D6.2(GND) D6.4(GND) D6.9(EP) D7.2(GND) D7.4(GND) D7.9(EP) D8.2(GND) D8.4(GND) D8.9(EP) D9.3(COM) D10.3(COM) D11.2(GND) D11.4(GND) D11.9(EP) D12.3(COM) D13.3(COM) D14.2(GND) D14.4(GND) D14.9(EP) D15.2(GND) D16.2(GND) D17.2(GND) D18.2(GND) D19.2(GND) DA5.1(GND) DD1.12(VSSA/VREFm/Power) DD1.18(VSS/Power) DD1.31(VSS/Power) DD1.47(VSS/Power) DD1.63(VSS/Power) H1.2 H3.2 L2.2 P1.2 P19.1 P22.1 R6.1 R29.1 R34.2 R35.1 R37.1 R38.1 R39.1 R54.1 R55.1 R60.1 R61.1 R65.1 R67.2 R68.2 R74.1 R76.1 U4.5(GND2) VT12.2(S) VT20.2(S) VT21.2(S)
PGND: C33.1 C34.1 C42.1 C43.1 C44.1 C45.1 C46.1 C47.1 C48.1 C49.1 L2.1 P48.1 P49.1 P50.1 P51.1 P52.1 P53.1 P54.1 P55.1 P56.1 P57.1 P58.1 P59.1 R8.2 R19.1 R41.1 R43.1 R69.1 R70.1 R71.2 R72.2 VD11.1(AC) VD11.3(AC) VD12.1(AC) VD12.3(AC) VT1.3(S) VT2.3(S) VT3.3(S) VT4.3(S) VT24.3(S) VT25.3(S) VT26.3(S) VT27.3(S)
VBAT: DD1.1(VBAT/Power) H1.3
VCC: C1.2 C2.2 C5.2 C6.2 C10.2 C11.2 C20.2 C21.2 C22.2 C23.2 C27.2 C35.2 C57.2 C63.2 C64.2 C65.2 C66.1 C67.1 D1.5(VDD) D2.5(VDD) D3.1(VS) D3.8(VS) D4.1(VS) D4.8(VS) D5.3(VCC) D6.3(VCC) D7.3(VCC) D8.3(VCC) D9.5(VDD) D10.5(VDD) D11.3(VCC) D12.5(VDD) D13.5(VDD) D14.3(VCC) DA5.3(IN) P1.1 R18.2 VD1.1(A) VD2.1(A) VD3.1(A) VD4.1(A) VD5.1(A) VD6.1(A) VD7.2(K) VD8.2(K) VD9.2(K)
AC1: P2.1 P3.1 P23.1 P24.1 P25.1 P26.1 VD10.1(AC) VD10.3(AC) VD11.2(C) VT26.2(D) VT27.2(D) VT28.2(D) VT29.2(D)
AC2: P27.1 P28.1 P29.1 P30.1 P31.1 P60.1 VD12.2(C) VD13.1(AC) VD13.3(AC) VT24.2(D) VT25.2(D) VT30.2(D) VT31.2(D)
ADC1_In8: DD1.8(PC0/I/O/GPIO_EXTI0) R11.1 R35.2
ADC1_In9: DD1.9(PC1/I/O/GPIO_EXTI1) R16.1 R37.2
ADC1_In11: DD1.26(PB0/I/O/COMP4_INPOPAMP2_VINP/) R28.1 R29.2
ADC1_In12: DD1.27(PB1/I/O) R74.2 R75.1
ADC2_In10: DD1.10(PC2/I/O/GPIO_EXTI2) R17.1 R38.2
ADC2_In11: DD1.11(PC3/I/O/GPIO_EXTI3) R18.1 R39.2
ADC2_In12: DD1.28(PB2/I/O) R76.2 R77.1
Akk1: P33.1 P34.1 P35.1 P36.1 P40.1 P41.1 R11.2 VD7.1(A) VT9.2(D) VT10.2(D) VT11.2(D) VT13.2(D) VT18.2(D) VT22.2(D)
Akk2: P16.1 P17.1 P32.1 P37.1 P38.1 P39.1 R16.2 VD8.1(A) VT5.2(D) VT6.2(D) VT16.2(D) VT17.2(D) VT19.2(D) VT23.2(D)
ALARM_BUZZ: DD1.2(PC13/Output/GPIO_Output) R6.2 VT12.1(G)
Boost1: C3.2 C4.2 D1.8(VB) D5.6(BOOST) VD1.2(K)
Boost2: C7.2 C8.2 D2.8(VB) D6.6(BOOST) VD2.2(K)
Boost3: C18.2 C19.2 D10.8(VB) D11.6(BOOST) VD4.2(K)
Boost4: C9.2 C12.2 D7.6(BOOST) D9.8(VB) VD3.2(K)
Boost5: C24.2 C25.2 D8.6(BOOST) D12.8(VB) VD5.2(K)
Boost6: C26.2 C62.2 D13.8(VB) D14.6(BOOST) VD6.2(K)
BOOT0: DD1.60(BOOT0/Boot) R34.1
Ch_Akk1: R30.1 R67.1 VT20.1(G)
Ch_Akk2: R62.1 R68.1 VT21.1(G)
Coil1: C3.1 C4.1 C18.1 C19.1 C24.1 C25.1 D1.6(VS) D5.8(TS) D8.8(TS) D10.6(VS) D11.8(TS) D12.6(VS) P4.1 P5.1 P6.1 P10.1 P11.1 P12.1 R20.1 R21.1 R22.1 VT1.2(D) VT2.2(D) VT5.3(S) VT6.3(S) VT7.3(S) VT8.3(S) VT9.3(S) VT10.3(S)
Coil2: C7.1 C8.1 C9.1 C12.1 C26.1 C62.1 D2.6(VS) D6.8(TS) D7.8(TS) D9.6(VS) D13.6(VS) D14.8(TS) P7.1 P8.1 P9.1 P13.1 P14.1 P15.1 R23.2 R24.1 R25.2 VT3.2(D) VT4.2(D) VT11.3(S) VT13.3(S) VT14.3(S) VT15.3(S) VT16.3(S) VT17.3(S)
DisCh_Akk1: R7.1 R71.1 VT22.1(G)
DisCh_Akk2: R59.1 R72.1 VT23.1(G)
Gen: P42.1 P43.1 P44.1 P45.1 P46.1 P47.1 R17.2 R63.1 R64.2 VD9.1(A) VT7.2(D) VT8.2(D) VT14.2(D) VT15.2(D) VT18.3(S) VT19.3(S)
Hrtim_ChA1: DD1.44(PA11/Output/GPIO_Output) R31.1
Hrtim_ChA2: DD1.43(PA10/Output/GPIO_Output) R3.1
Hrtim_ChB1: DD1.42(PA9/Output/GPIO_Output) R4.1
Hrtim_ChB2: DD1.41(PA8/Output/GPIO_Output) R5.1
Hrtim_ChC1: DD1.33(PB12/I/O) R12.2
Hrtim_ChC2: DD1.34(PB13/I/O/ADC1_IN13) R13.2
Hrtim_ChD1: DD1.35(PB14/Output/GPIO_Output) R14.2
Hrtim_ChD2: DD1.36(PB15/Output/GPIO_Output) R15.2
Hrtim_ChE1: DD1.39(PC8/Output/GPIO_Output) R9.1
Hrtim_ChE2: DD1.40(PC9/Output/GPIO_Output) R10.1
Left_Dwn: D1.4(LO) D3.6(OUT) D3.7(OUT) R26.1
Left_Dwn_In: D1.2(LIN) D3.2(IN) R3.2
Left_Rec: D18.3(IN+) D19.3(2A) R9.2 R58.2
Left_Up1: D1.7(HO) D5.7(TG) R27.1
Left_Up1_In: D1.1(HIN) D5.1(INP) R5.2
Left_Up2: D10.7(HO) D11.7(TG) R51.1
Left_Up2_In: D10.1(HIN) D11.1(INP) R12.1
Left_Up3: D8.7(TG) D12.7(HO) R52.1
Left_Up3_In: D8.1(INP) D12.1(HIN) R14.1
NRST: C30.1 DD1.7(NRST/Reset) H1.1 R33.2
OSC32_IN: C39.1 X2.1(OSC1)
OSC32_In: DD1.3(PC14/OSC32_IN/I/O)
OSC32_OUT: C40.1 X2.2(OSC2)
OSC32_Out: DD1.4(PC15/OSC32_OUT/I/O)
OSC_In: C38.2 DD1.5(PF0/OSC_IN/I/O/RCC_OSC_IN/) Q3.2(OSC2)
OSC_Out: C13.2 DD1.6(PF1/OSC_OUT/I/O) Q3.1(OSC1)
Right_Dwn: D2.4(LO) D4.6(OUT) D4.7(OUT) R1.2
Right_Dwn_In: D2.2(LIN) D4.2(IN) R31.2
Right_Rec: D17.3(IN+) D19.1(1A) R10.2 R65.2
Right_Up1: D2.7(HO) D6.7(TG) R36.2
Right_Up1_In: D2.1(HIN) D6.1(INP) R4.2
Right_Up2: D7.7(TG) D9.7(HO) R32.2
Right_Up2_In: D7.1(INP) D9.1(HIN) R13.1
Right_Up3: D13.7(HO) D14.7(TG) R2.2
Right_Up3_In: D13.1(HIN) D14.1(INP) R15.1
SWDCLK: DD1.49(PA14/I/O) H3.3
SWDIO: DD1.46(PA13/I/O) H3.1
Tim2_Ch1: DD1.14(PA0/I/O/TIM2_CH1) R7.2
Tim2_Ch2: DD1.15(PA1/I/O/TIM2_CH2) R30.2
Tim15_Ch1: DD1.16(PA2/I/O/ADC1_IN3) R59.2
Tim15_Ch2: DD1.17(PA3/I/O) R62.2
UGND: C14.1 C16.2 C17.1 C53.1 C54.1 C55.1 C56.1 R49.1 U1.7(GND) U1.18(GND) U1.21(GND) U1.25(AGND) U1.26(TEST) U4.4(GND1) USB1.4(GND) USB1.5(EH)
USART1_RX: U4.6(OUTB)
Usart1_RX: DD1.59(PB7/I/O)
USART1_TX: U4.7(INA)
Usart1_TX: DD1.58(PB6/I/O)
VOUT: C33.2 C34.2 C42.2 C43.2 C44.2 C45.2 C46.2 C47.2 C48.2 C49.2 C50.1 C51.1 C52.1 C58.1 D15.1(EN) D15.5(VDD) D16.1(EN) D16.5(VDD) D17.1(EN) D17.5(VDD) D18.1(EN) D18.5(VDD) P67.1 P68.1 P69.1 P70.1 P71.1 P72.1 P73.1 P74.1 P75.1 P76.1 P77.1 P78.1 R28.2
Net-(B1-2): B1.2 VT12.3(D)
Net-(C14-2): C14.2 C17.2 C53.2 C54.2 L5.2 R47.2 R48.2 R50.2 U1.4(VCCIO) U1.20(VCC) U4.1(VCC1)
Net-(C16-1): C16.1 C56.2 L5.1 USB1.1(VCC)
Net-(C55-2): C55.2 U1.17(3V3OUT)
Net-(D9-2): D9.2(LIN) R54.2
Net-(D10-2): D10.2(LIN) R55.2
Net-(D12-2): D12.2(LIN) R60.2
Net-(D13-2): D13.2(LIN) R61.2
Net-(D15-3): D15.3(IN+) R73.1
Net-(D15-4): D15.4(OUT) R53.2
Net-(D16-3): D16.3(IN+) R66.1
Net-(D16-4): D16.4(OUT) R42.2
Net-(D17-4): D17.4(OUT) R40.2
Net-(D18-4): D18.4(OUT) R57.2
Net-(D19-4): D19.4(2Y) R66.2
Net-(D19-6): D19.6(1Y) R73.2
Net-(LED1-1): LED1.1(K) U1.23(CBUS0)
Net-(LED1-2): LED1.2(A) R47.1
Net-(LED2-1): LED2.1(K) U1.22(CBUS1)
Net-(LED2-2): LED2.2(A) R48.1
Net-(P20-1): P20.1 R75.2
Net-(P21-1): P21.1 R77.2
Net-(P61-1): P61.1 P62.1 P63.1 P64.1 P65.1 P66.1 R44.1 R56.1 VD10.2(C) VD13.2(C) VT28.3(S) VT29.3(S) VT30.3(S) VT31.3(S)
Net-(R1-1): R1.1 R19.2 VT3.1(G) VT4.1(G)
Net-(R2-1): R2.1 R24.2 VT14.1(G) VT15.1(G)
Net-(R8-1): R8.1 R26.2 VT1.1(G) VT2.1(G)
Net-(R20-2): R20.2 R51.2 VT5.1(G) VT6.1(G)
Net-(R21-2): R21.2 R52.2 VT7.1(G) VT8.1(G)
Net-(R22-2): R22.2 R27.2 VT9.1(G) VT10.1(G)
Net-(R23-1): R23.1 R36.1 VT11.1(G) VT13.1(G)
Net-(R25-1): R25.1 R32.1 VT16.1(G) VT17.1(G)
Net-(R40-1): R40.1 R41.2 VT24.1(G) VT25.1(G)
Net-(R42-1): R42.1 R43.2 VT26.1(G) VT27.1(G)
Net-(R44-2): R44.2 R53.1 VT28.1(G) VT29.1(G)
Net-(R45-1): R45.1 USB1.2(D-)
Net-(R45-2): R45.2 U1.16(USBDM)
Net-(R46-1): R46.1 USB1.3(D+)
Net-(R46-2): R46.2 U1.15(USBDP)
Net-(R49-2): R49.2 R50.1 U1.19(RESET)
Net-(R56-2): R56.2 R57.1 VT30.1(G) VT31.1(G)
Net-(R63-2): R63.2 VT19.1(G) VT21.3(D)
Net-(R64-1): R64.1 VT18.1(G) VT20.3(D)
Net-(R69-2): R69.2 VT23.3(S)
Net-(R70-2): R70.2 VT22.3(S)
Net-(U1-1): U1.1(TXD) U4.3(INB)
Net-(U1-5): U1.5(RXD) U4.2(OUTA)

Not connected (* = marked no-connect by the designer): D3 3(NC); D4 3(NC); D5 5(NC); D6 5(NC); D7 5(NC); D8 5(NC); D9 4(LO); D10 4(LO); D11 5(NC); D12 4(LO); D13 4(LO); D14 5(NC); DD1 20(PA4/I/O/DAC1_OUT1/) 21(PA5/I/O) 22(PA6/I/O/ADC2_IN3OPAMP2_VOUT) 23(PA7/I/O/COMP2_INP/) 24(PC4/I/O) 25(PC5/I/O) 29(PB10/I/O) 30(PB11/I/O/COMP6_INP/) 37(PC6/Output/GPIO_Output) 38(PC7/Output/GPIO_Output) 45(PA12/Output/GPIO_Output) 50(PA15/I/O) 51(PC10/Output/GPIO_Output) 52(PC11/Output/GPIO_Output) 53(PC12/Output/GPIO_Output) 54(PD2/Output/GPIO_Output) 55(PB3/I/O) 56(PB4/I/O) 57(PB5/I/O) 61(PB8/I/O) 62(PB9/I/O); U1 2(DTR) 3(RTS) 6(RI) 8(NC) 9(DSR) 10(DCD) 11(CTS) 12(CBUS4) 13(CBUS2) 14(CBUS3) 24(NC) 27(OSCI) 28(OSCO)

## Notes on the sheets
sheet 1
- VCC
